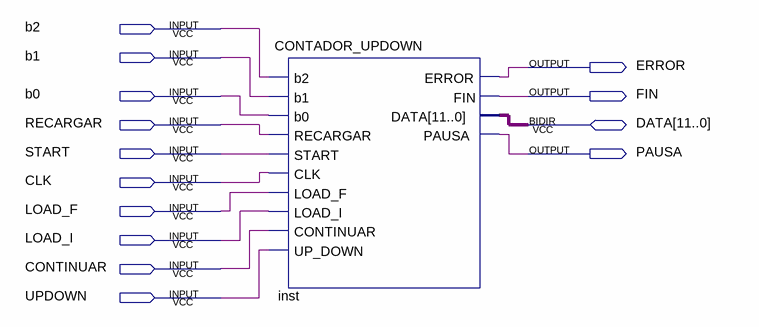
[diagram p0: schematic sheet]
// Quartus schematic MAIN.bdf as structural Verilog: 1 symbols, 14 pins
module MAIN (
  input  b2,
  input  b1,
  input  b0,
  input  RECARGAR,
  input  START,
  input  CLK,
  input  LOAD_F,
  input  LOAD_I,
  input  CONTINUAR,
  input  UPDOWN,
  inout  [11:0] DATA,
  output ERROR,
  output FIN,
  output PAUSA
);

  CONTADOR_UPDOWN inst (
    .b2(b2), .b1(b1), .b0(b0), .RECARGAR(RECARGAR), .START(START), .CLK(CLK), .LOAD_F(LOAD_F),
    .LOAD_I(LOAD_I), .CONTINUAR(CONTINUAR), .UP_DOWN(UPDOWN), .ERROR(ERROR), .FIN(FIN), .PAUSA(PAUSA),
    .DATA(DATA));
endmodule
